# Altium schematic sheet 2_powerSupply.SchDoc
size A4
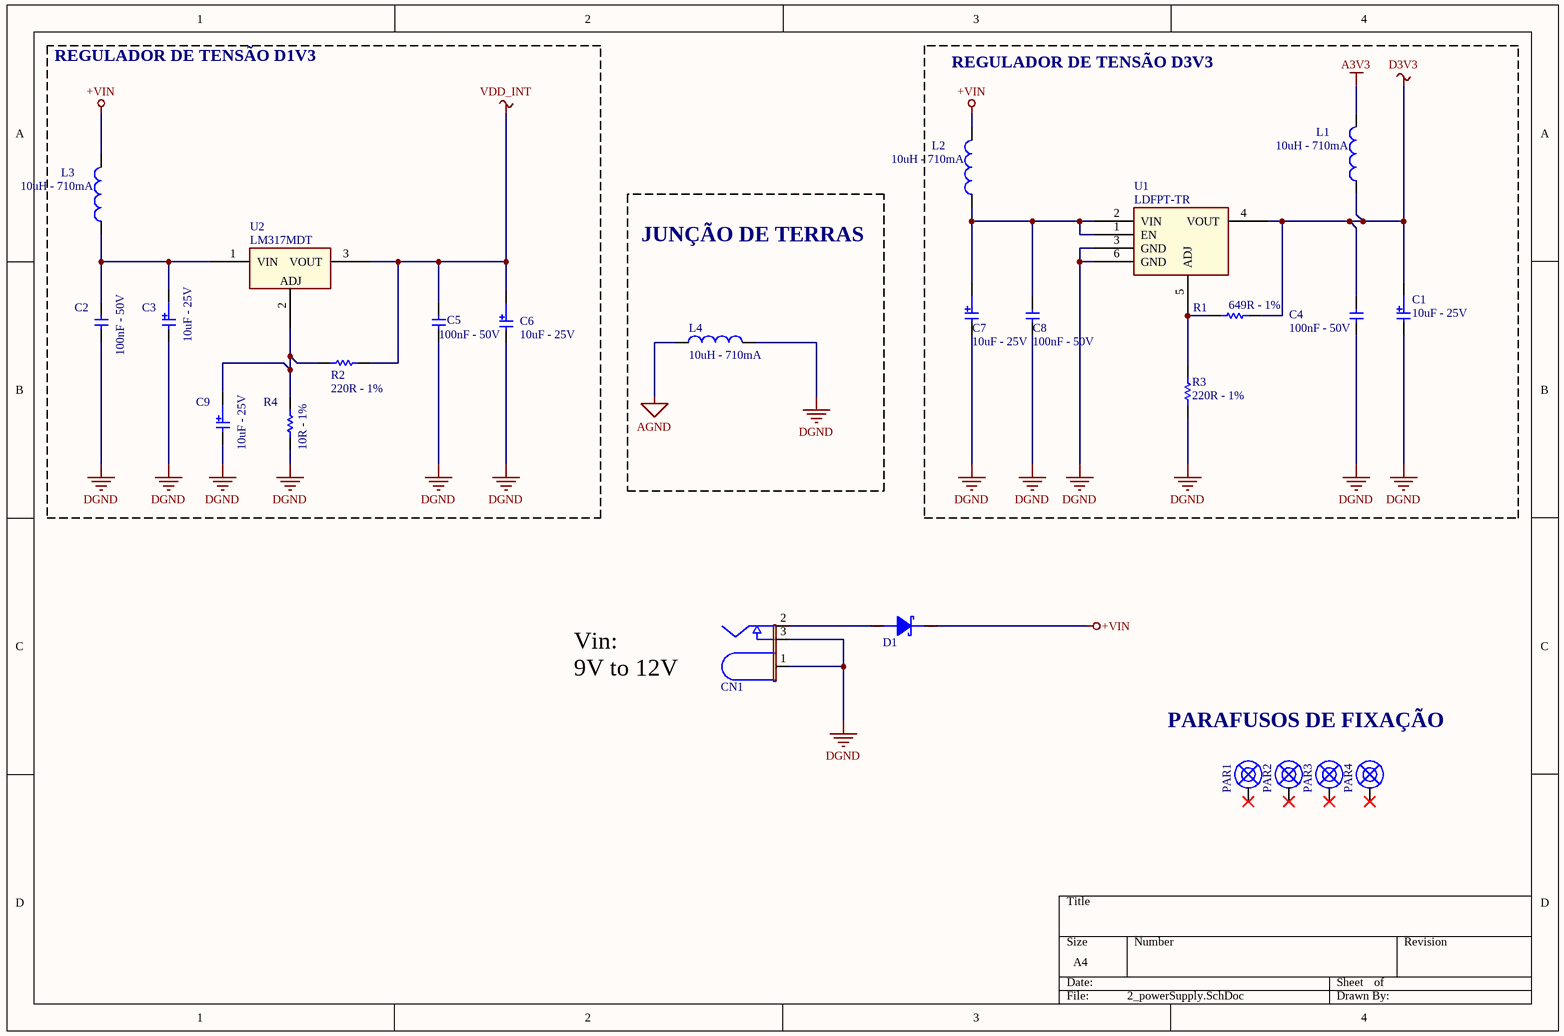
[diagram p0: 2_powerSupply.SchDoc]

## Parts
C1  VALOR: 10uF - 25V  [SMD2412-CAP]  (hidden comment: 10uF - 25V - 10% - SMD2412 - 5430)
C2  VALOR: 100nF - 50V  [SMD0805-CAP]  (hidden comment: Capacitor 100nF - 50V)
C3  VALOR: 10uF - 25V  [SMD2412-CAP]  (hidden comment: 10uF - 25V - 10% - SMD2412 - 5430)
C4  VALOR: 100nF - 50V  [SMD0805-CAP]  (hidden comment: Capacitor 100nF - 50V)
C5  VALOR: 100nF - 50V  [SMD0805-CAP]  (hidden comment: Capacitor 100nF - 50V)
C6  VALOR: 10uF - 25V  [SMD2412-CAP]  (hidden comment: 10uF - 25V - 10% - SMD2412 - 5430)
C7  VALOR: 10uF - 25V  [SMD2412-CAP]  (hidden comment: 10uF - 25V - 10% - SMD2412 - 5430)
C8  VALOR: 100nF - 50V  [SMD0805-CAP]  (hidden comment: Capacitor 100nF - 50V)
C9  VALOR: 10uF - 25V  [SMD2412-CAP]  (hidden comment: 10uF - 25V - 10% - SMD2412 - 5430)
CN1  Conector POWER JACK 2.5MM  [RAPC712X]  (value not drawn)
D1  Diodo B2100-13-F (SMB)  [SMB]  (value not drawn)
L1  VALOR: 10uH - 710mA  [WE-TPC-S]  (hidden comment: Indutor 10uH 710mA SMD)
L2  VALOR: 10uH - 710mA  [WE-TPC-S]  (hidden comment: Indutor 10uH 710mA SMD)
L3  VALOR: 10uH - 710mA  [WE-TPC-S]  (hidden comment: Indutor 10uH 710mA SMD)
L4  VALOR: 10uH - 710mA  [WE-TPC-S]  (hidden comment: Indutor 10uH 710mA SMD)
PAR1  Parafuso M3 - 1295  [FURO/142/240/M4/CHASSI]  (value not drawn)
PAR2  Parafuso M3 - 1295  [FURO/142/240/M4/CHASSI]  (value not drawn)
PAR3  Parafuso M3 - 1295  [FURO/142/240/M4/CHASSI]  (value not drawn)
PAR4  Parafuso M3 - 1295  [FURO/142/240/M4/CHASSI]  (value not drawn)
R1  VALOR: 649R - 1%  [SMD0805]  (hidden comment: 649R- 1% - 0805 - 466)
R2  VALOR: 220R - 1%  [SMD0805]  (hidden comment: 220R - 1% - 0805 - 381)
R3  VALOR: 220R - 1%  [SMD0805]  (hidden comment: 220R - 1% - 0805 - 381)
R4  VALOR: 10R - 1%  [SMD0805]  (hidden comment: 10R - 1% - 0805 - 344)
U1  VALOR: LDFPT-TR  [PPAK-5]  (hidden comment: CI LDFPT-TR)
U2  VALOR: LM317MDT  [TO252]  (hidden comment: LM317MDT (TO252) 713)

## Blocks framed on the sheet
REGULADOR DE TENSÃO D1V3: C2 C3 C5 C6 C9 L3 R2 R4 U2
REGULADOR DE TENSÃO D3V3: C1 C4 C7 C8 L1 L2 R1 R3 U1
JUNÇÃO DE TERRAS: L4

## Nets
+VIN: D1.2(K) L2.2 L3.2
A3V3: L1.2
AGND: L4.1
D3V3: C1.1(+) C4.1 L1.1 R1.2 U1.4(VOUT)
DGND: C1.2(-) C2.2 C3.2(-) C4.2 C5.2 C6.2(-) C7.2(-) C8.2 C9.2(-) CN1.1 CN1.3 L4.2 R3.1 R4.1 U1.3(GND) U1.6(GND)
VDD_INT: C5.1 C6.1(+) R2.2 U2.3(VOUT)
NetC2_1: C2.1 C3.1(+) L3.1 U2.1(VIN)
NetC7_1: C7.1(+) C8.1 L2.1 U1.1(EN) U1.2(VIN)
NetC9_1: C9.1(+) R2.1 R4.2 U2.2(ADJ)
NetCN1_2: CN1.2 D1.1(A)
NetR1_1: R1.1 R3.2 U1.5(ADJ)

Not connected (* = marked no-connect by the designer): PAR1 1*; PAR2 1*; PAR3 1*; PAR4 1*

## Notes on the sheet
- Vin:
  9V to 12V
- PARAFUSOS DE FIXAÇÃO

## Library data of the parts
C1 C3 C6 C7 C9 = 10uF - 25V - 10% - SMD2412 - 5430: Capacitor 10uF, SDM TANTALUM; MANUFACTURER: AVX; PARTNUMBER: TBJC106K025LBSB0024; CODIGO: 5430; DESC: CAP 10uF, 25V, SMD2412, 10%, LOW ESR, TANTALUM; PSpiceTemplate: C^@REFDES %+ %- ?TOLERANCE¦C^@REFDES¦ @VALUE ?IC/IC=@IC/ ?TOLERANCE¦\n.model C^@REFDES CAP C=1 DEV=@TOLERANCE%¦; EMBALAGEM: BULK; FORNECEDOR: MOUSER; ComponentLinK1Description: Datasheet; ComponentLink1URL: http://www.mouser.com/ds/2/40/tbj-12472.pdf; ComponentLink2Description: COMPONENT PAGE; ComponentLink2URL: http://br.mouser.com/ProductDetail/AVX/TBJC106K025LBSB0024/?qs=sGAEpiMZZMuEN2agSAc2pscrdRLVHCGN2%2fr%2fCTD1deQ%3d; ENCAPSULAMENTO: SMD2412; FACTORY PACK: 200; LOCALIZAÇÃO: *; Supplier 1: Mouser; Supplier Part Number 1: 647-UWX1E100MCL1
C2 C4 C5 C8 = Capacitor 100nF - 50V: Capacitor 100nF, SMD 0805; PARTNUMBER: 08055G104ZAT2A; MANUFACTURER: AVX; PSpiceTemplate: C^@REFDES %1 %2 ?TOLERANCE¦C^@REFDES¦ @VALUE ?IC/IC=@IC/ ?TOLERANCE¦\n.model C^@REFDES CAP C=1 DEV=@TOLERANCE%¦; VOLTAGE: CMAX; DESC: CAP 100nF, 50V, SMD0805, Z%, Y5V, CERAMICO MULTICAMADA; CODIGO: 1760; EMBALAGEM: REEL; FORNECEDOR: MOUSER; FOOTPRINT: SMD0805; ComponentLinK1Description: Datasheet; ComponentLink1URL: http://www.mouser.com/ds/2/40/cy5v-5766.pdf; ComponentLink2Description: HOME AVX; ComponentLink2URL: http://www.avx.com/; ENCAPSULAMENTO: SMD0805; FACTORY PACK: 4000; LOCALIZAÇÃO: *; Supplier 1: Mouser; Supplier Part Number 1: 581-08055G104Z
CN1 = CNC POWER JACK 2.5MM - 4414: MANUFACTURER: SWITCHCRAFT; CODIGO: 4414; DESC: CNC PCI, JACK 2.5MM, ALIMENTACAO CC, 90G, 5A, PRETO; FORNECEDOR: MOUSER; EMBALAGEM: BULK; PARTNUMBER: RAPC712X; VALOR: Conector POWER JACK 2.5MM; LOCALIZAÇÃO: *; FACTORY PACK: 2500; ENCAPSULAMENTO: *; ComponentLink2URL: http://www.switchcraft.com; ComponentLink2Description: HOME SWITCHCRAFT; ComponentLink1URL: http://www.switchcraft.com/productsummary.aspx?Parent=581; ComponentLinK1Description: Datasheet; Supplier Part Number 1: 502-RAPC712X; NCM: 8536.90.40
D1 = Diodo B2100-13-F (SMB): MANUFACTURER: DIODES INC; CODE: xxxx; DESC: DIODO SCHOTTKY, 100V, 2A, B2100-13-F, SMB; EMBALAGEM: REEL; FORNCEDOR: MOUSER; PARTNUMBER: B2100-13-F; ComponentLinK1Description: Datasheet; ComponentLink1URL: http://www.mouser.com/ds/2/115/ds30021-83821.pdf; ComponentLink2Description: HOME DIODES INC; ComponentLink2URL: www.diodes.com; ENCAPSULAMENTO: SMB; FACTORY PACK: 3000; LOCALIZAÇÃO: *; VALOR: B2100-13-F; Supplier 1: Mouser; Supplier Part Number 1: 621-B2100-F
L1-L4 = 10uH - 710mA - SMD - 3058: PARTNUMBER: LQH3NPN100NJ0L; MANUFACTURER: MURATA; CODIGO: 3058; DESC: INDUTOR, FIXO SMD, 10uH, 710mA, 30%TOL; EMBALAGEM: REEL; FORNECEDOR: MOUSER; TARGET MÁX U$: $0,1263; ComponentLinK1Description: Datasheet; ComponentLink1URL: http://www.farnell.com/datasheets/1668060.pdf; ComponentLink2Description: HOME MURATA; ComponentLink2URL: www.murata.com; ENCAPSULAMENTO: WE-TPC-S; FACTORY PACK: 1000; LOCALIZAÇÃO: *; Supplier Part Number 1: 81-LQH3NPN100NJ0L; NCM: 8504.50.00
PAR1-PAR4 = Parafuso M3 - 1295: Parafuso M3; CODIGO: 1295; ENCAPSULAMENTO: PTH; DESC: PARAFUSO M3; VALOR: Parafuso M3; ComponentLinK1Description: Datasheet; ComponentLink1URL: *; ComponentLink2Description: *; ComponentLink2URL: *; EMBALAGEM: *; FACTORY PACK: *; FORNECEDOR: *; LOCALIZAÇÃO: *; MANUFACTURER: *; PARTNUMBER: *; NCM: 7318.15.00
R1 = 649R - 1% - 0805 - 466: Resistor 649R, 1%, SMD 0805; PARTNUMBER: RC2012F6490CS; MANUFACTURER: SAMSUNG; CODIGO: 466; EMBALAGEM: REEL; FORNECEDOR: VARIOS; DESC: RES 6K49, 1%, SMD 0805, MF; TARGET MÁX U$: $0.0015; LOCALIZAÇÃO: *; ENCAPSULAMENTO: SMD0805; FACTORY PACK: 5000; Supplier 1: Digi-Key; Supplier Part Number 1: RC2012F6490CS; ComponentLink1Description: Datasheet; ComponentLink1URL: http://media.digikey.com/pdf/Data%20Sheets/Samsung%20PDFs/CHIP_RESISTOR_Catalog.pdf; ComponentLink2Description: HOME SANSUNG; ComponentLink2URL: http://www.samsung.com/global/business/semiconductor/; NCM: 8533.21.20
R2 R3 = 220R - 1% - 0805 - 381: Resistor 220R, 1%, SMD 0805; PARTNUMBER: ERJ-6ENF2200V; MANUFACTURER: SAMSUNG; CODIGO: 381; EMBALAGEM: REEL; FORNECEDOR: VARIOS; DESC: RES 220R, 1%, SMD 0805, MF; TARGET MÁX U$: $0.0015; LOCALIZAÇÃO: *; ENCAPSULAMENTO: SMD0805; FACTORY PACK: 5000; ComponentLink1Description: Datasheet; ComponentLink1URL: http://avnetexpress.avnet.com/store/em/EMController/_/A-5002847221649/An-0?action=part&catalogId=500201&langId=-1&storeId=500201&CMP=KNC-SupplyFrame_VSE-T11; ComponentLink2URL: http://www.samsung.com/global/business/semiconductor/; Supplier 1: AVNET; NCM: 8533.21.20
  R2: ComponentLink2Description: HOME SAMSUNG; Supplier Part Number 1: RC2012F2200V
  R3: ComponentLink2Description: HOME SANSUNG; Supplier Part Number 1: RC2012F2400CS
R4 = 10R - 1% - 0805 - 344: Resistor 10R, 1%, SMD 0805; PARTNUMBER: RC2012F10R0CS; MANUFACTURER: SANSUNG; CODIGO: 344; EMBALAGEM: REEL; FORNECEDOR: VARIOS; DESC: RES 10R, 1%, SMD 0805, MF; TARGET MÁX U$: $0.0015; LOCALIZAÇÃO: *; ENCAPSULAMENTO: SMD0805; FACTORY PACK: 5000; ComponentLink1Description: Datasheet; ComponentLink1URL: http://download.siliconexpert.com/pdfs/2012/12/5/3/46/2/282/samelm_/manual/rcseries1.pdf; ComponentLink2Description: HOME SANSUNG; ComponentLink2URL: http://www.samsung.com/global/business/semiconductor/; Supplier 1: Arrow; Supplier Part Number 1: 51841909S9970589N4139; NCM: 8533.21.20
U1 = CI LDFPT-TR: MANUFACTURER: ST MICROELETRONICS; CODIGO: 5218; DESC: CI, LDFPT-TR, 1 A VERY LOW DROP VOLTAGE REGULATOR, PPAK; EMBALAGEM: REEL; FORNECEDOR: VARIOS; ComponentLinK1Description: Datasheet; ComponentLink1URL: http://www.st.com/st-web-ui/static/active/en/resource/technical/document/datasheet/DM00099995.pdf; ComponentLink2Description: HOME ST; ComponentLink2URL: http://www.st.com/web/en/home.html; ENCAPSULAMENTO: PPAK-5; FACTORY PACK: 2500; LOCALIZAÇÃO: *; PARTNUMBER: LDFPT-TR; Supplier Part Number 1: LDFPT-TR; Supplier 1: AVNET
U2 = LM317MDT (TO252) 713: CI LM317MDT; MANUFACTURER: NATIONAL; DESC: LM317, 3 TERMINAL AJUSTABLE REGULATOR, TO252-DPACK; CODIGO: 713; FORNECEDOR: MOUSER; ENCAPSULAMENTO: SMD/SMT - TO-252; EMBALAGEM: REEL; PARTNUMBER: LM317MDT; LOCALIZAÇÃO: *; FACTORY PACK: 2500; ComponentLink2URL: http://www.st.com/web/en/home.html; ComponentLink2Description: HOME ST; ComponentLink1URL: http://www.st.com/web/en/resource/technical/document/datasheet/CD00000549.pdf; ComponentLinK1Description: Datasheet; Supplier 1: Mouser; Supplier Part Number 1: 511-LM317MDT